# Altium project 200317 Brake Module R4.PrjPcb
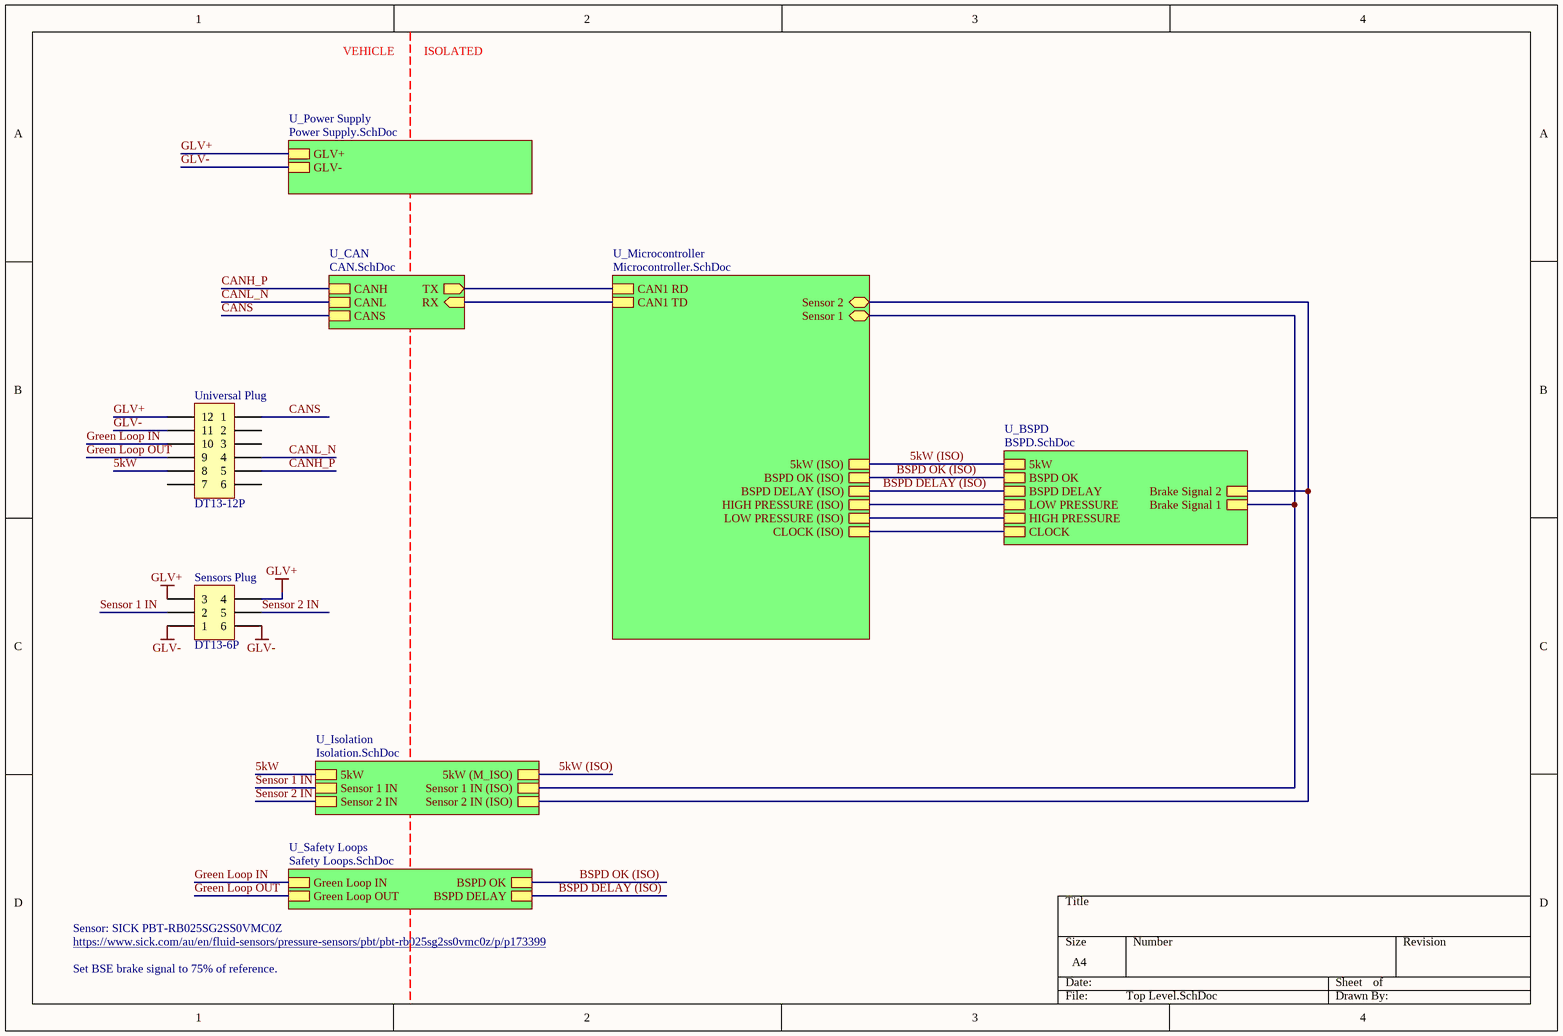
[diagram p0: Top Level.SchDoc]
8 sheets, 168 parts. Net scope: hierarchical (ports join the sheet entries above them; power ports are global).
Board file: Brake Module PCB.PcbDoc
Sheets:
  Top Level.SchDoc
    U_BSPD = BSPD.SchDoc
    U_Microcontroller = Microcontroller.SchDoc
    U_Safety Loops = Safety Loops.SchDoc
    U_Power Supply = Power Supply.SchDoc
    U_CAN = CAN.SchDoc
    U_Isolation = Isolation.SchDoc
      U_Input Filter = Input Filter.SchDoc

## Sheet Top Level.SchDoc
size A4

### Parts
Sensors_Plug  DT13-6P  [DT13-6P]
Universal_Plug  DT13-12P  [DT13-12P]

### Sub-sheets
U_BSPD = BSPD.SchDoc: BSPD OK, HIGH PRESSURE, LOW PRESSURE, CLOCK, 5kW, Brake Signal 1, Brake Signal 2, BSPD DELAY
U_CAN = CAN.SchDoc: CANS, RX (in), CANL, CANH, TX (out)
U_Isolation = Isolation.SchDoc: 5kW, 5kW (M_ISO), Sensor 2 IN, Sensor 1 IN, Sensor 2 IN (ISO), Sensor 1 IN (ISO)
U_Microcontroller = Microcontroller.SchDoc: BSPD OK (ISO), 5kW (ISO), CLOCK (ISO), HIGH PRESSURE (ISO), LOW PRESSURE (ISO), Sensor 2 (bidir), Sensor 1 (bidir), CAN1 RD, CAN1 TD, BSPD DELAY (ISO)
U_Power Supply = Power Supply.SchDoc: GLV+, GLV-
U_Safety Loops = Safety Loops.SchDoc: Green Loop OUT, Green Loop IN, BSPD OK, BSPD DELAY

### Nets
GLV+: Sensors_Plug.3 Sensors_Plug.4 Universal_Plug.12 ; sheet U_Power Supply/GLV+
GLV-: Sensors_Plug.1 Sensors_Plug.6 Universal_Plug.11 ; sheet U_Power Supply/GLV-
5kW: Universal_Plug.8 ; sheet U_Isolation/5kW
5kW (ISO): sheet U_BSPD/5kW, sheet U_Microcontroller/5kW (ISO), sheet U_Isolation/5kW (M_ISO)
BSPD DELAY (ISO): sheet U_BSPD/BSPD DELAY, sheet U_Microcontroller/BSPD DELAY (ISO), sheet U_Safety Loops/BSPD DELAY
BSPD OK (ISO): sheet U_BSPD/BSPD OK, sheet U_Microcontroller/BSPD OK (ISO), sheet U_Safety Loops/BSPD OK  [project net BSPD OK]
CANH_P: Universal_Plug.5 ; sheet U_CAN/CANH
CANL_N: Universal_Plug.4 ; sheet U_CAN/CANL
CANS: Universal_Plug.1 ; sheet U_CAN/CANS
CLOCK: sheet U_BSPD/CLOCK, sheet U_Microcontroller/CLOCK (ISO)
Green Loop IN: Universal_Plug.10 ; sheet U_Safety Loops/Green Loop IN
Green Loop OUT: Universal_Plug.9 ; sheet U_Safety Loops/Green Loop OUT
Sensor 1 IN: Sensors_Plug.2 ; sheet U_Isolation/Sensor 1 IN
Sensor 2 IN: Sensors_Plug.5 ; sheet U_Isolation/Sensor 2 IN
NetC33_1: sheet U_BSPD/Brake Signal 1, sheet U_Microcontroller/Sensor 1, sheet U_Isolation/Sensor 1 IN (ISO)
NetC38_1: sheet U_BSPD/Brake Signal 2, sheet U_Microcontroller/Sensor 2, sheet U_Isolation/Sensor 2 IN (ISO)
NetCAN_RX#2_1: sheet U_Microcontroller/CAN1 TD, sheet U_CAN/RX
NetCAN_TX#2_1: sheet U_Microcontroller/CAN1 RD, sheet U_CAN/TX
NetHigh_P_1: sheet U_BSPD/HIGH PRESSURE, sheet U_Microcontroller/LOW PRESSURE (ISO)
NetLow_P_1: sheet U_BSPD/LOW PRESSURE, sheet U_Microcontroller/HIGH PRESSURE (ISO)

Not connected (* = marked no-connect by the designer): Universal_Plug 2 3 6 7

### Notes on the sheet
- VEHICLE
- ISOLATED
- Sensor: SICK PBT-RB025SG2SS0VMC0Z
- https://www.sick.com/au/en/fluid-sensors/pressure-sensors/pbt/pbt-rb025sg2ss0vmc0z/p/p173399
- Set BSE brake signal to 75% of reference.

### Library data of the parts
Sensors_Plug = DT13-6P[[/\]]DT13-6P: Positions: 6; Pitch: 4.44mm; Row Spacing: 6.35mm; Angle: 90; Flange: Yes; Contact: Copper Alloy; Part Number: DT13-6P; Digikey Part Number: 1734-1025-ND; Digikey Link: https://www.digikey.com/product-detail/en/te-connectivity-deutsch-connectors/DT13-6P/1734-1025-ND/6566589
Universal_Plug = DT13-12P[[/\]]DT13-12P: Positions: 12; Pitch: 4.44mm; Row Spacing: 6.35mm; Angle: 90; Flange: Yes; Contact: Nickel; Part Number: DT13-12P; Digikey Part Number: 1734-1451-ND; Digikey Link: https://www.digikey.com.au/product-detail/en/te-connectivity-deutsch-connectors/DT13-12PA/1734-1451-ND/7220123

## Sheet BSPD.SchDoc
size A4
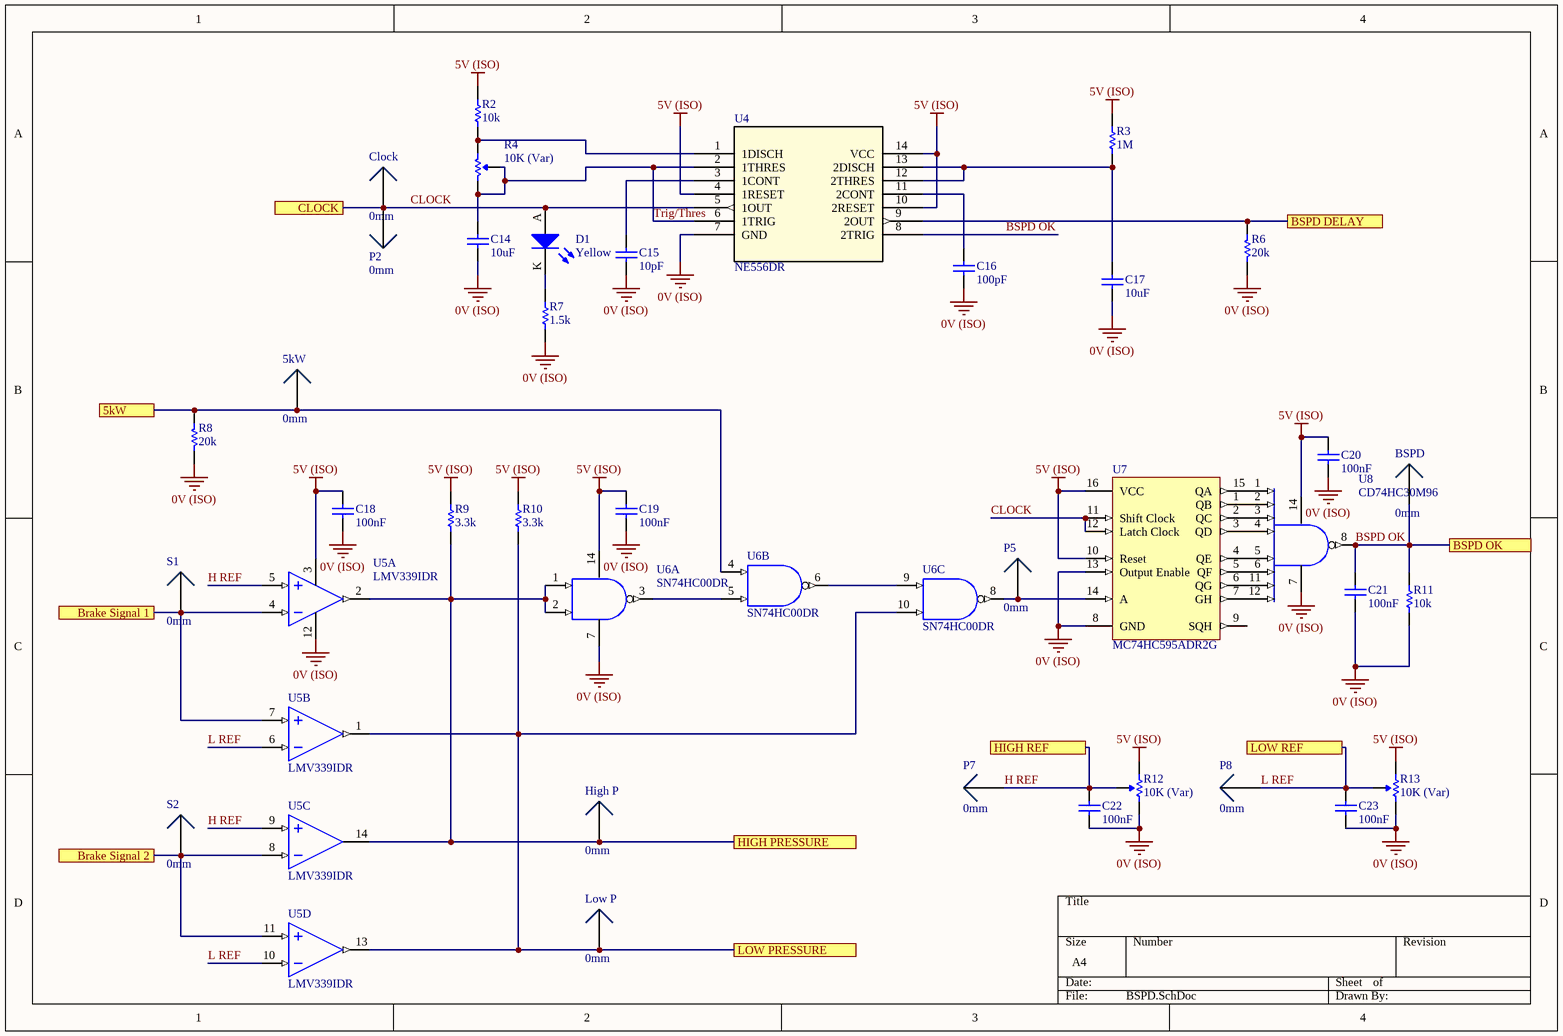
[diagram p1: BSPD.SchDoc]

### Parts
5kW  0mm  [SMD Test Point]
BSPD  0mm  [SMD Test Point]
C14  10uF  [0805]
C15  10pF  [0805]
C16  100pF  [0805]
C17  10uF  [0805]
C18  100nF  [0805]
C19  100nF  [0805]
C20  100nF  [0805]
C21  100nF  [0805]
C22  100nF  [0805]
C23  100nF  [0805]
Clock  0mm  [SMD Test Point]
D1  Yellow  [0805 LED]
High_P  0mm  [SMD Test Point]
Low_P  0mm  [SMD Test Point]
P2  0mm  [TH Test Point]
P5  0mm  [SMD Test Point]
P7  0mm  [TH Test Point]
P8  0mm  [TH Test Point]
R2  10k  [0805]
R3  1M  [0805]
R4  10K (Var)  [B 3296]
R6  20k  [0805]
R7  1.5k  [0805]
R8  20k  [0805]
R9  3.3k  [0805]
R10  3.3k  [0805]
R11  10k  [0805]
R12  10K (Var)  [B 3296]
R13  10K (Var)  [B 3296]
S1  0mm  [TH Test Point]
S2  0mm  [TH Test Point]
U4  NE556DR  [TI 14-SOIC]
U5  LMV339IDR  [TI 14-SOIC]  (parts A,B,C,D of 4)
U6  SN74HC00DR  [TI 14-SOIC]  (parts A,B,C of 4)
U7  MC74HC595ADR2G  [ON 16-SOIC]
U8  CD74HC30M96  [TI 14-SOIC]

### Ports
5kW, Brake Signal 1, Brake Signal 2, BSPD DELAY, BSPD OK, CLOCK, HIGH PRESSURE, HIGH REF, LOW PRESSURE, LOW REF

### Nets
0V (ISO): C14.1 C15.1 C16.1 C17.1 C18.1 C19.1 C20.1 C21.1 C22.1 C23.1 R6.2 R7.1 R8.2 R11.1 R12.1(CCW) R13.1(CCW) U4.7(GND) U5.12(V-) U6.7(GND) U7.8(GND) U7.13(Output_Enable) U8.7(GND)
5V (ISO): C18.2 C19.2 C20.2 R2.2 R3.2 R9.2 R10.2 R12.3(CW) R13.3(CW) U4.4(1RESET) U4.10(2RESET) U4.14(VCC) U5.3(V+) U6.14(VCC) U7.10(Reset) U7.16(VCC) U8.14(VCC)
5kW (ISO): 5kW.1 R8.1 U6.4(2A) ; port 5kW
BSPD DELAY (ISO): R6.1 U4.9(2OUT) ; port BSPD DELAY
BSPD OK: BSPD.1 C21.2 R11.2 U4.8(2TRIG) U8.8(Output) ; port BSPD OK
CLOCK: Clock.1 D1.A P2.1 U4.5(1OUT) U7.11(Shift_Clock) U7.12(Latch_Clock) ; port CLOCK
H REF: C22.2 P7.1 R12.2(Wiper) U5.5(IN_A+) U5.9(IN_C+) ; port HIGH REF
L REF: C23.2 P8.1 R13.2(Wiper) U5.6(IN_B-) U5.10(IN_D-) ; port LOW REF
Trig/Thres: C14.2 R4.1(CCW) R4.2(Wiper) U4.2(1THRES) U4.6(1TRIG)
NetC15_2: C15.2 U4.3(1CONT)
NetC16_2: C16.2 U4.11(2CONT)
NetC17_2: C17.2 R3.1 U4.12(2THRES) U4.13(2DISCH)
NetC33_1: S1.1 U5.4(IN_A-) U5.7(IN_B+) ; port Brake Signal 1
NetC38_1: S2.1 U5.8(IN_C-) U5.11(IN_D+) ; port Brake Signal 2
NetD1_K: D1.K R7.2
NetHigh_P_1: High_P.1 R9.1 U5.2(OUT_A) U5.14(OUT_C) U6.1(1A) U6.2(1B) ; port HIGH PRESSURE
NetLow_P_1: Low_P.1 R10.1 U5.1(OUT_B) U5.13(OUT_D) U6.10(3B) ; port LOW PRESSURE
NetP5_1: P5.1 U6.8(3Y) U7.14(A)
NetR2_1: R2.1 R4.3(CW) U4.1(1DISCH)
NetU6_3: U6.3(1Y) U6.5(2B)
NetU6_6: U6.6(2Y) U6.9(3A)
NetU7_1: U7.1(QB) U8.2(Input)
NetU7_2: U7.2(QC) U8.3(Input)
NetU7_3: U7.3(QD) U8.4(Input)
NetU7_4: U7.4(QE) U8.5(Input)
NetU7_5: U7.5(QF) U8.6(Input)
NetU7_6: U7.6(QG) U8.11(Input)
NetU7_7: U7.7(GH) U8.12(Input)
NetU7_15: U7.15(QA) U8.1(Input)

Not connected (* = marked no-connect by the designer): U7 9(SQH)

### Library data of the parts
5kW BSPD Clock High_P Low_P P5 = SMD Test Point: Positions: 1; Row Spacing: 0; Flange: No; Contact: NA; Part Number: SMD Test Point; Pitch: 0mm; Angle: 0
C14 C17 = GRM21BR6YA106KE43L: Manufacturer: muRata; Tolerance: 10%; Material: X5R; Rated Voltage: 50V; Part Number: GRM21BR6YA106KE43L; Value: 10uF; Digikey Part Number: 490-10514-6-ND
C15 = GRM21A5C2E100JW01D: Manufacturer: muRata; Tolerance: ±5%; Material: C0G, NP0; Rated Voltage: 250V; Part Number: GRM21A5C2E100JW01D; Value: 10pF; Digikey Part Number: 490-5530-1-ND
C16 = GCM2165C1H101JA16D: Manufacturer: muRata; Tolerance: ±5%; Material: C0G, NP0; Rated Voltage: 50V; Part Number: GCM2165C1H101JA16D; Value: 100pF; Digikey Part Number: 490-8031-1-ND
C18 C20-C23 = GCM21BR71H104KA37L: Manufacturer: muRata; Tolerance: ±10%; Material: X7R; Rated Voltage: 50V; Part Number: GCM21BR71H104KA37L; Value: 100nF; Digikey Part Number: 490-6064-1-ND
C19 = GCM21BR71E104KA37L: Manufacturer: muRata; Tolerance: 10%; Material: X7R; Rated Voltage: 25V; Part Number: GCM21BR71E104KA37L; Value: 100nF
D1 = SML-211YTT86: Yellow LED Indication - Discrete 1.75V 0805 (2012 Metric); Manufacturer: ROHM Semiconductor; Part Number: SML-211YTT86; Colour: Yellow; Digikey Part Number: 511-1293-1-ND; Digikey Link: https://www.digikey.com/product-detail/en/rohm-semiconductor/SML-211YTT86/511-1293-1-ND/637106
P2 P7 P8 S1 S2 = TH Test Point: Positions: 1; Angle: 0; Flange: No; Contact: NA; Part Number: TH Test Point; Pitch: 0mm; Row Spacing: 0mm
R2 R11 = RC0805FR0710KL: Manufacturer: YAGEO; Tolerance: 0.01; Rated Voltage: 0.125W; Part Number: RC0805FR0710KL; Value: 10k; Material: FR-07
R3 = RC0805FR071ML: Manufacturer: YAGEO; Tolerance: 0.01; Rated Voltage: 0.125W; Part Number: RC0805FR071ML; Value: 1M; Material: FR-07
R4 R12 R13 = 3296W-1-103LF: Manufacturer: Bournes Inc; Tolerance: 0.1; Rated Voltage: 0.5W; Part Number: 3296W-1-103LF; Value: 10K (Var); Digikey Part Number: 3296W-103LF-ND
R6 R8 = RC0805FR0720KL: Manufacturer: YAGEO; Tolerance: 0.01; Rated Voltage: 0.125W; Part Number: RC0805FR0720KL; Value: 20k; Material: FR-07
R7 = RC0805FR071K5L: Manufacturer: YAGEO; Tolerance: 0.01; Rated Voltage: 0.125W; Part Number: RC0805FR071K5L; Value: 1.5k; Material: FR-07
R9 R10 = RC0805FR073K3L: Manufacturer: YAGEO; Tolerance: 0.01; Rated Voltage: 0.125W; Part Number: RC0805FR073K3L; Value: 3.3k; Material: FR-07
U4 = NE556DR: IC OSC TIMER DUAL 100KHZ 14SOIC; Manufacturer: Texas Instruments; Part Number: NE556DR; Digikey Part Number: 296-26240-1-ND; Digikey Link: https://www.digikey.com/product-detail/en/texas-instruments/NE556DR/296-26240-1-ND/2254905
U5 = LMV339IDR: Comparator General Purpose Open Collector 14-SOIC; Manufacturer: Texas Instruments; Part Number: LMV339IDR; Digikey Part Number: 296-6611-2-ND; Digikey Link: https://www.digikey.com/product-detail/en/texas-instruments/LMV339MTX-NOPB/296-35446-1-ND/3739150
U6 = SN74HC00DR: NAND Gate IC 4 Channel 14-SOIC; Manufacturer: Texas Instruments; Part Number: SN74HC00DR; Digikey Part Number: 296-1187-2-ND; Digikey Link: https://www.digikey.com.au/product-detail/en/texas-instruments/SN74HC00DR/296-1187-2-ND/276830
U7 = MC74HC595ADR2G: IC SHIFT REGISTR 8BIT 3ST 16SOIC; Manufacturer: ON Semiconductor; Part Number: MC74HC595ADR2G; Digikey Part Number: MC74HC595ADR2GOSCT-ND; Digikey Link: https://www.digikey.com/product-detail/en/on-semiconductor/MC74HC595ADR2G/MC74HC595ADR2GOSCT-ND/1139727
U8 = CD74HC30M96: IC GATE NAND 1CH 8-INP 14SOIC; Manufacturer: Texas Instruments; Part Number: CD74HC30M96; Digikey Part Number: 296-14521-1-ND; Digikey Link: https://www.digikey.com/product-detail/en/texas-instruments/CD74HC30M96/296-14521-1-ND/555580

## Sheet Microcontroller.SchDoc
size A3
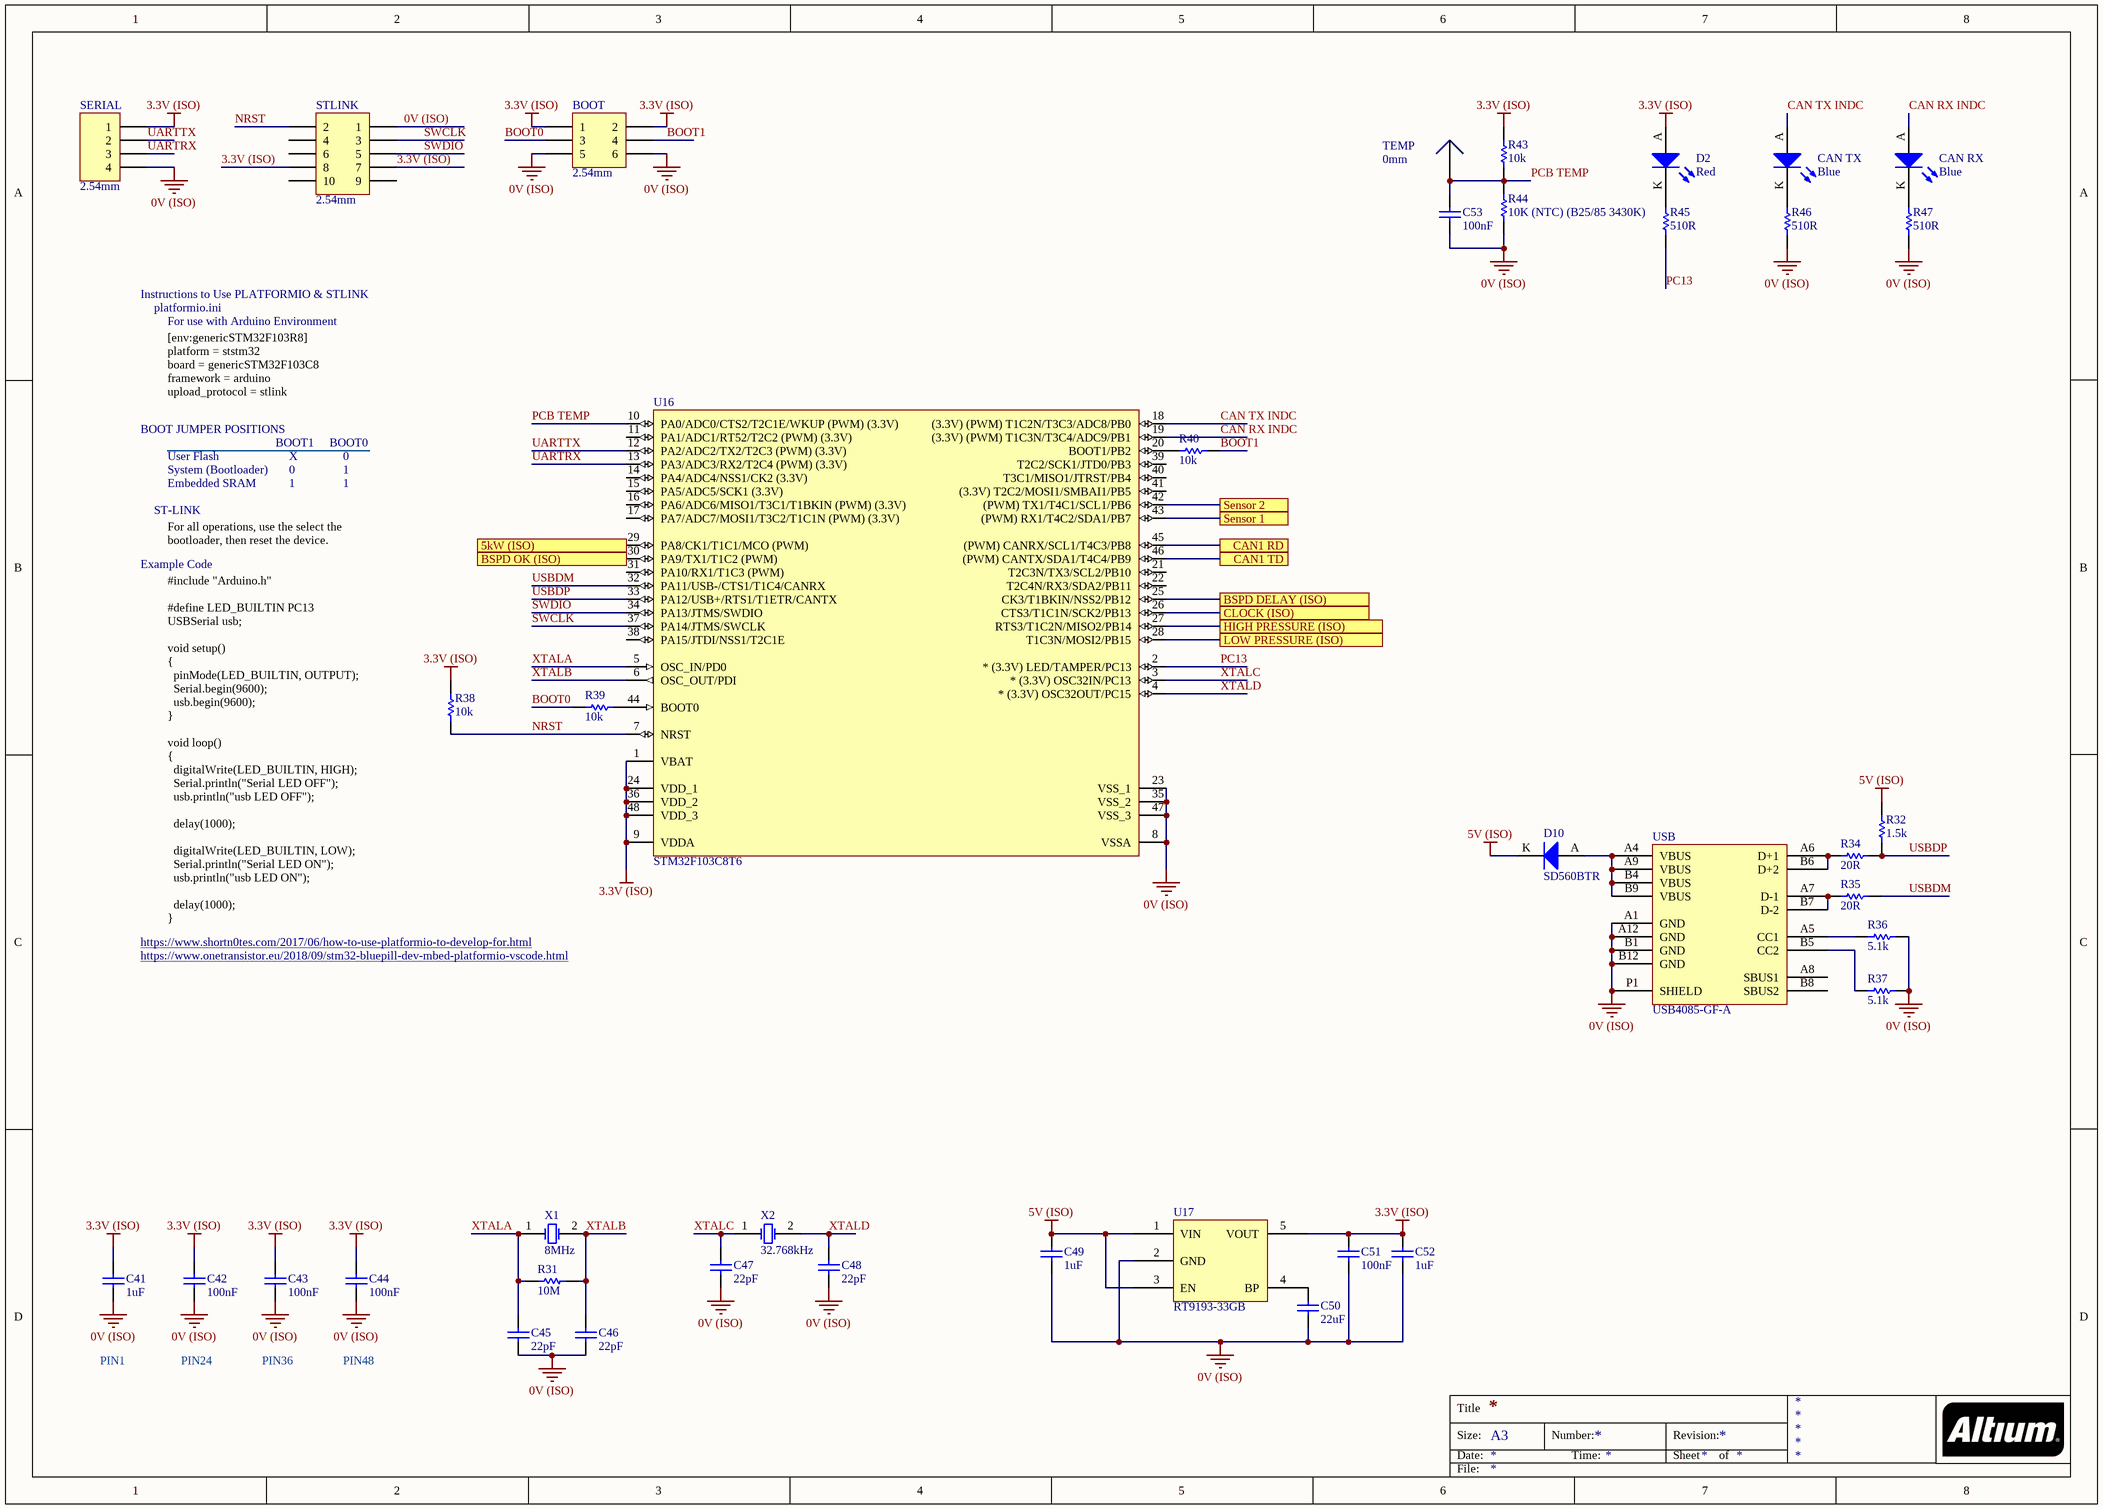
[diagram p2: Microcontroller.SchDoc]

### Parts
(Parts that share a designator on the sheet are numbered #1, #2 ... from top to bottom, then left to right.)
BOOT  2.54mm  [TH 2.54mm Header 2x3]
C41  1uF  [0805]
C42  100nF  [0805]
C43  100nF  [0805]
C44  100nF  [0805]
C45  22pF  [0805]
C46  22pF  [0805]
C47  22pF  [0805]
C48  22pF  [0805]
C49  1uF  [0805]
C50  22uF  [1206]
C51  100nF  [0805]
C52  1uF  [0805]
C53  100nF  [0805]
CAN_RX#1  Blue  [0805 LED]
CAN_TX#1  Blue  [0805 LED]
D2  Red  [0805 LED]
D10  SD560BTR  [SMB Diode]
R31  10M  [0805]
R32  1.5k  [0805]
R34  20R  [0805]
R35  20R  [0805]
R36  5.1k  [0805]
R37  5.1k  [0805]
R38  10k  [0805]
R39  10k  [0805]
R40  10k  [0805]
R43  10k  [0805]
R44  10K (NTC) (B25/85 3430K)  [0805]
R45  510R  [0805]
R46  510R  [0805]
R47  510R  [0805]
SERIAL  2.54mm  [TH 2.54mm Header 1x4]
STLINK  2.54mm  [TH 2.54mm Header 2x5]
TEMP  0mm  [SMD Test Point]
U16  STM32F103C8T6  [STM 48-LQFP]
U17  RT9193-33GB  [RICHTEK SOT-23-5]
USB  USB4085-GF-A  [USB4085-GF-A]
X1  8MHz  [Abracon HC-49/US]
X2  32.768kHz  [EPSON 2-SMD]

### Ports
5kW (ISO), BSPD DELAY (ISO), BSPD OK (ISO), CAN1 RD, CAN1 TD, CLOCK (ISO), HIGH PRESSURE (ISO), LOW PRESSURE (ISO), Sensor 1, Sensor 2

### Nets
0V (ISO): BOOT.5 BOOT.6 C41.1 C42.1 C43.1 C44.1 C45.1 C46.1 C47.1 C48.1 C49.1 C50.1 C51.1 C52.1 C53.1 R36.2 R37.2 R44.1 R46.1 R47.1 SERIAL.4 STLINK.1 U16.8(VSSA) U16.23(VSS_1) U16.35(VSS_2) U16.47(VSS_3) U17.2(GND) USB.A1(GND) USB.A12(GND) USB.B1(GND) USB.B12(GND) USB.P1(SHIELD)
3.3V (ISO): BOOT.1 BOOT.2 C41.2 C42.2 C43.2 C44.2 C51.2 C52.2 D2.A R38.2 R43.2 SERIAL.1 STLINK.7 STLINK.8 U16.1(VBAT) U16.9(VDDA) U16.24(VDD_1) U16.36(VDD_2) U16.48(VDD_3) U17.5(VOUT)
5V (ISO): C49.2 D10.K R32.2 U17.1(VIN) U17.3(EN)
5kW (ISO): U16.29(PA8/CK1/T1C1/MCO_(PWM)) ; port 5kW (ISO)
BOOT0: BOOT.3 R39.1
BOOT1: BOOT.4 R40.2
BSPD DELAY (ISO): U16.25(CK3/T1BKIN/NSS2/PB12) ; port BSPD DELAY (ISO)
BSPD OK: U16.30(PA9/TX1/T1C2_(PWM)) ; port BSPD OK (ISO)
CAN RX INDC: CAN_RX#1.A U16.19((3.3V)_(PWM)_T1C3N/T3C4/ADC9/PB1)
CAN TX INDC: CAN_TX#1.A U16.18((3.3V)_(PWM)_T1C2N/T3C3/ADC8/PB0)
CLOCK: U16.26(CTS3/T1C1N/SCK2/PB13) ; port CLOCK (ISO)
NRST: R38.1 STLINK.2 U16.7(NRST)
PC13: R45.1 U16.2(*_(3.3V)_LED/TAMPER/PC13)
PCB TEMP: C53.2 R43.1 R44.2 TEMP.1 U16.10(PA0/ADC0/CTS2/T2C1E/WKUP_(PWM)_(3.3V))
SWCLK: STLINK.3 U16.37(PA14/JTMS/SWCLK)
SWDIO: STLINK.5 U16.34(PA13/JTMS/SWDIO)
UARTRX: SERIAL.3 U16.13(PA3/ADC3/RX2/T2C4_(PWM)_(3.3V))
UARTTX: SERIAL.2 U16.12(PA2/ADC2/TX2/T2C3_(PWM)_(3.3V))
USBDM: R35.2 U16.32(PA11/USB-/CTS1/T1C4/CANRX)
USBDP: R32.1 R34.2 U16.33(PA12/USB+/RTS1/T1ETR/CANTX)
XTALA: C45.2 R31.1 U16.5(OSC_IN/PD0) X1.1(OSC1)
XTALB: C46.2 R31.2 U16.6(OSC_OUT/PDI) X1.2(OSC2)
XTALC: C47.2 U16.3(*_(3.3V)_OSC32IN/PC13) X2.1(OSC1)
XTALD: C48.2 U16.4(*_(3.3V)_OSC32OUT/PC15) X2.2(OSC2)
NetC33_1: U16.43((PWM)_RX1/T4C2/SDA1/PB7) ; port Sensor 1
NetC38_1: U16.42((PWM)_TX1/T4C1/SCL1/PB6) ; port Sensor 2
NetC50_2: C50.2 U17.4(BP)
NetCAN_RX#1_K: CAN_RX#1.K R47.2
NetCAN_RX#2_1: U16.46((PWM)_CANTX/SDA1/T4C4/PB9) ; port CAN1 TD
NetCAN_TX#1_K: CAN_TX#1.K R46.2
NetCAN_TX#2_1: U16.45((PWM)_CANRX/SCL1/T4C3/PB8) ; port CAN1 RD
NetD2_K: D2.K R45.2
NetD10_A: D10.A USB.A4(VBUS) USB.A9(VBUS) USB.B4(VBUS) USB.B9(VBUS)
NetHigh_P_1: U16.28(T1C3N/MOSI2/PB15) ; port LOW PRESSURE (ISO)
NetLow_P_1: U16.27(RTS3/T1C2N/MISO2/PB14) ; port HIGH PRESSURE (ISO)
NetR34_1: R34.1 USB.A6(D+1) USB.B6(D+2)
NetR35_1: R35.1 USB.A7(D-1) USB.B7(D-2)
NetR36_1: R36.1 USB.A5(CC1)
NetR37_1: R37.1 USB.B5(CC2)
NetR39_2: R39.2 U16.44(BOOT0)
NetR40_1: R40.1 U16.20(BOOT1/PB2)

Not connected (* = marked no-connect by the designer): STLINK 4 6 9 10; U16 11(PA1/ADC1/RT52/T2C2_(PWM)_(3.3V)) 14(PA4/ADC4/NSS1/CK2_(3.3V)) 15(PA5/ADC5/SCK1_(3.3V)) 16(PA6/ADC6/MISO1/T3C1/T1BKIN_(PWM)_(3.3V)) 17(PA7/ADC7/MOSI1/T3C2/T1C1N_(PWM)_(3.3V)) 21(T2C3N/TX3/SCL2/PB10) 22(T2C4N/RX3/SDA2/PB11) 31(PA10/RX1/T1C3_(PWM)) 38(PA15/JTDI/NSS1/T2C1E) 39(T2C2/SCK1/JTD0/PB3) 40(T3C1/MISO1/JTRST/PB4) 41((3.3V)_T2C2/MOSI1/SMBAI1/PB5); USB A8(SBUS1) B8(SBUS2)

### Notes on the sheet
- Instructions to Use PLATFORMIO & STLINK
- platformio.ini
- For use with Arduino Environment
- BOOT JUMPER POSITIONS
- [env:genericSTM32F103R8]
  platform = ststm32
  board = genericSTM32F103C8
  framework = arduino
  upload_protocol = stlink
- BOOT1
- BOOT0
- ST-LINK
- User Flash
- System (Bootloader)
- Embedded SRAM
- X
- 1
- 0
- Example Code
- For all operations, use the select the bootloader, then reset the device.
- #include "Arduino.h"
  #define LED_BUILTIN PC13
  USBSerial usb;
  void setup()
  {
  pinMode(LED_BUILTIN, OUTPUT);
  Serial.begin(9600);
  usb.begin(9600);
  }
  void loop()
  {
  digitalWrite(LED_BUILTIN, HIGH);
  Serial.println("Serial LED OFF");
  usb.println("usb LED OFF");
  delay(1000);
  digitalWrite(LED_BUILTIN, LOW);
  Serial.println("Serial LED ON");
  usb.println("usb LED ON");
  delay(1000);
  }
- https://www.shortn0tes.com/2017/06/how-to-use-platformio-to-develop-for.html
- https://www.onetransistor.eu/2018/09/stm32-bluepill-dev-mbed-platformio-vscode.html
- PIN1
- PIN24
- PIN36
- PIN48
- Title
- Size:
- Date:
- A3
- Number:
- Time:
- Revision:
- Sheet
- of
- File:

### Library data of the parts
BOOT = TH 2.54mm Header 2x3: Positions: 6; Angle: 0; Flange: No; Contact: NA; Part Number: TH 2.54mm Header 2x3; Pitch: 2.54mm; Row Spacing: 2.54mm
C41 C49 C52 = AC0805KKX7R8BB105: Manufacturer: YAGEO; Tolerance: 10%; Material: X7R; Rated Voltage: 25V; Part Number: AC0805KKX7R8BB105; Value: 1uF
C42-C44 C51 C53 = GCM21BR71H104KA37L: as C18 on sheet BSPD; Part Number: GCM21BR71H104KA37L; Value: 100nF; Digikey Part Number: 490-6064-1-ND
C45-C48 = GRM21A5C2E220JW01D: Manufacturer: muRata; Tolerance: ±5%; Material: C0G, NP0; Rated Voltage: 250V; Part Number: GRM21A5C2E220JW01D; Value: 22pF; Digikey Part Number: 490-5534-1-ND
C50 = CC1206MKX5R7BB226: Manufacturer: YAGEO; Tolerance: 20%; Material: Ceramic; Rated Voltage: 16V; Part Number: CC1206MKX5R7BB226; Value: 22uF; Digikey Part Number: 311-1997-2-ND
CAN_RX#1 CAN_TX#1 = SML-MN2BCTT86C: LED BLUE CLEAR 2012 SMD; Manufacturer: ROHM Semiconductor; Part Number: SML-MN2BCTT86C; Colour: Blue; Digikey Part Number: 846-1207-1-ND; Digikey Link: https://www.digikey.com/product-detail/en/rohm-semiconductor/SMLMN2BCTT86C/846-1207-1-ND/6057239
D2 = SML-210LTT86: Red LED Indication - Discrete 1.75V 0805 (2012 Metric); Manufacturer: ROHM Semiconductor; Part Number: SML-210LTT86; Colour: Red; Digikey Part Number: 511-1286-1-ND; Digikey Link: https://www.digikey.com/product-detail/en/rohm-semiconductor/SML-210LTT86/511-1286-1-ND/637099
D10 = SD560BTR: 1.2V_F 600V 5A SMB; Manufacturer: SMC Diode Solutions; Part Number: SD560BTR; Digikey Part Number: 1655-1530-2-ND; Digikey Link: https://www.digikey.com/product-detail/en/smc-diode-solutions/SD560BTR/1655-1530-2-ND/6022620
R31 = RC0805FR0710ML: Manufacturer: YAGEO; Tolerance: 0.01; Rated Voltage: 0.125W; Part Number: RC0805FR0710ML; Value: 10M; Material: FR-07
R32 = RC0805FR071K5L: as R7 on sheet BSPD; Part Number: RC0805FR071K5L; Value: 1.5k; Material: FR-07
R34 R35 = RC0805FR0720RL: Manufacturer: YAGEO; Tolerance: 0.01; Rated Voltage: 0.125W; Part Number: RC0805FR0720RL; Value: 20R; Material: FR-07
R36 R37 = RC0805FR075K1L: Manufacturer: YAGEO; Tolerance: 0.01; Rated Voltage: 0.125W; Part Number: RC0805FR075K1L; Value: 5.1k; Material: FR-07
R38-R40 R43 = RC0805FR0710KL: as R2 on sheet BSPD; Part Number: RC0805FR0710KL; Value: 10k; Material: FR-07
  R38 R39: Digikey Part Number: 311-10.0KCRCT-ND
R44 = NTCS0805E3103FLT: Manufacturer: Vishay Beyschlag; Tolerance: 0.01; Rated Voltage: 210mW; Part Number: NTCS0805E3103FLT; Value: 10K (NTC) (B25/85 3430K); Digikey Part Number: BC2733CT-ND
R45-R47 = RC0805FR07510RL: Manufacturer: YAGEO; Tolerance: 0.01; Rated Voltage: 0.125W; Part Number: RC0805FR07510RL; Value: 510R; Material: FR-07
SERIAL = TH 2.54mm Header 1x4: Positions: 4; Angle: 0; Flange: No; Contact: NA; Part Number: TH 2.54mm Header 1x4; Pitch: 2.54mm; Row Spacing: 2.54mm
STLINK = TH 2.54mm Header 2x5: Positions: 10; Angle: 0; Flange: No; Contact: NA; Part Number: TH 2.54mm Header 2x5; Pitch: 2.54mm; Row Spacing: 2.54mm
TEMP = SMD Test Point: as 5kW on sheet BSPD; Part Number: SMD Test Point; Pitch: 0mm; Angle: 0
U16 = STM32F103C8T6: ARM® Cortex®-M3 STM32F1 Microcontroller IC 32-Bit 72MHz 64KB (64K x 8) FLASH; Manufacturer: STMicroelectronics; Part Number: STM32F103C8T6; Digikey Part Number: 497-6063-ND; Digikey Link: https://www.digikey.com/product-detail/en/stmicroelectronics/STM32F103C8T6/497-6063-ND/1646338
U17 = RT9193-33GB: IC REG LINEAR 3.3V 300MA SOT23-5; Manufacturer: Richtek; Part Number: RT9193-33GB; Digikey Part Number: 1028-1014-1-ND; Digikey Link: https://www.digikey.com/products/en?keywords=1028-1014-1-ND
USB = USB4085-GF-A: USB - C (Type - C) USB 2.0 Receptacle Connector 16 Position Through Hole, Right Angle; Angle: 90; Part Number: USB4085-GF-A; Digikey Part Number: 2073-USB4085-GF-ACT-ND; Digikey Link: https://www.digikey.ee/product-detail/en/gct/USB4085-GF-A/2073-USB4085-GF-ACT-ND/9859733
X1 = ABLS-8.000MHZ-B4-T: Manufacturer: Abracon LLC; Load Capacitance: 18pF; ESR: 80R; Part Number: ABLS-8.000MHZ-B4-T; Value: 8MHz; Digikey Part Number: 535-10212-2-ND; Digikey Link: https://www.digikey.com/product-detail/en/abracon-llc/ABLS-8.000MHZ-B4-T/535-10212-2-ND/2184155
X2 = FC-135 32.7680KA-A5: Manufacturer: EPSON; Load Capacitance: 12.5pF; ESR: 70k; Part Number: FC-135 32.7680KA-A5; Value: 32.768kHz; Digikey Part Number: SER4103TR-ND; Digikey Link: https://www.digikey.com/product-detail/en/epson/FC-135-32.7680KA-A5/SER4103TR-ND/5259895

## Sheet Safety Loops.SchDoc
size A4
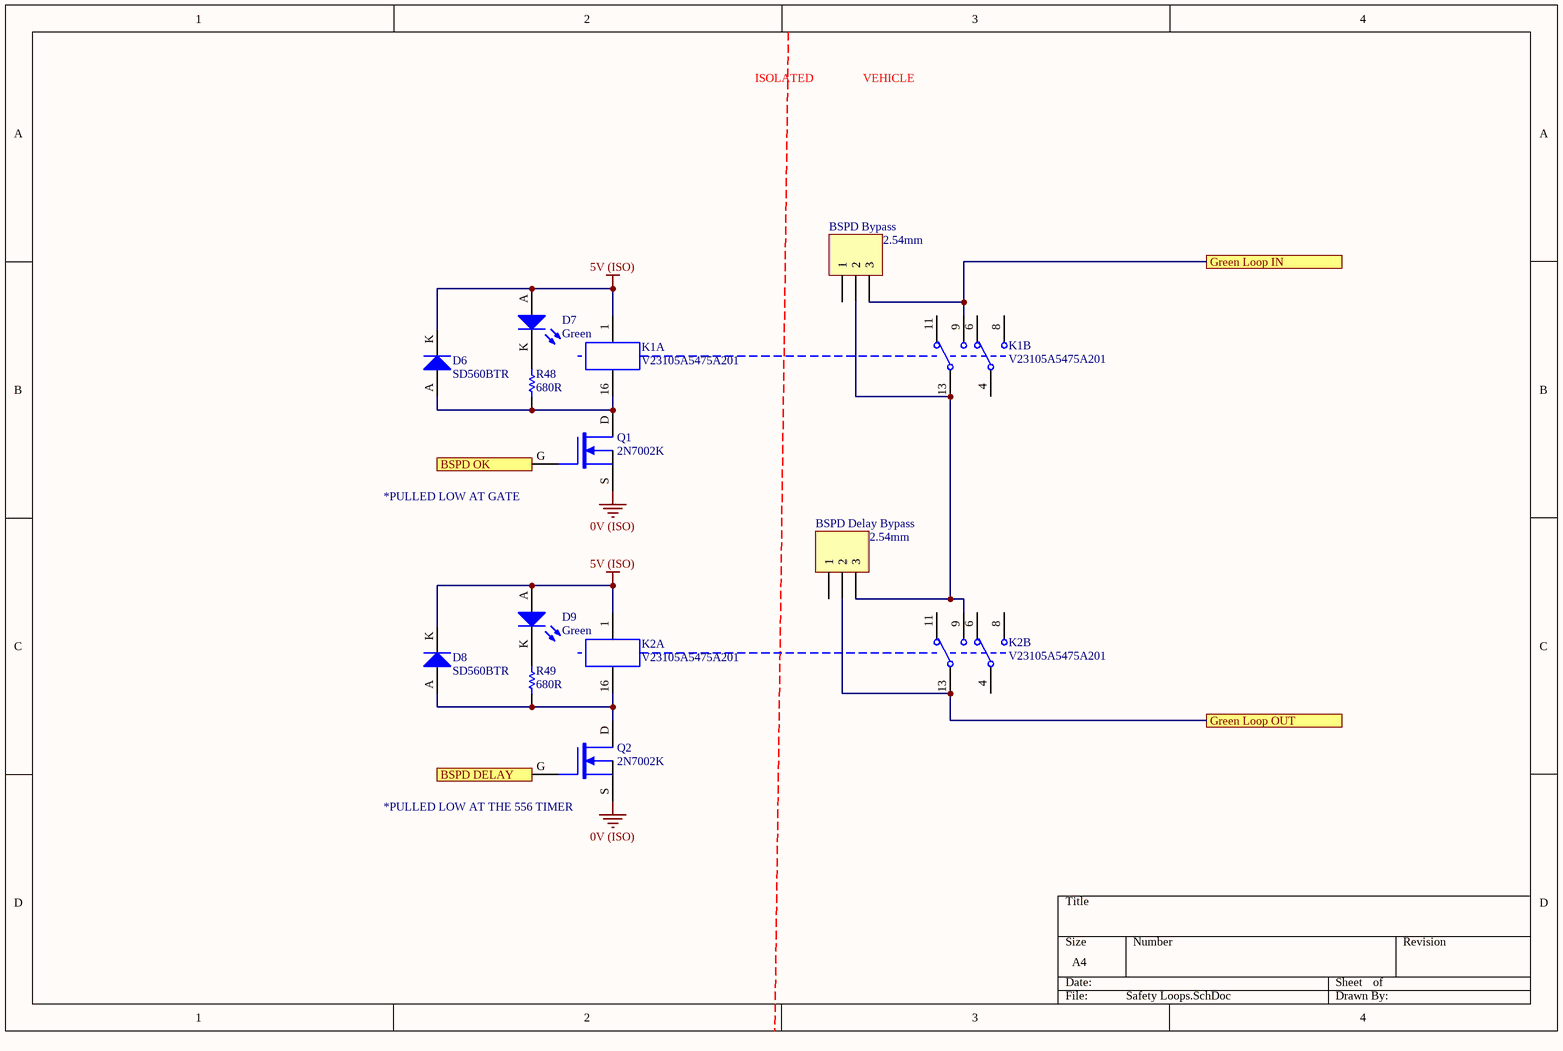
[diagram p3: Safety Loops.SchDoc]

### Parts
BSPD_Bypass  2.54mm  [TH 2.54mm Header 1x3]
BSPD_Delay_Bypass  2.54mm  [TH 2.54mm Header 1x3]
D6  SD560BTR  [SMB Diode]
D7  Green  [0805 LED]
D8  SD560BTR  [SMB Diode]
D9  Green  [0805 LED]
K1  V23105A5475A201  [TI 2-DIL]  (parts A,B of 2)
K2  V23105A5475A201  [TI 2-DIL]  (parts A,B of 2)
Q1  2N7002K  [ON SOT-23 MOSFET]
Q2  2N7002K  [ON SOT-23 MOSFET]
R48  680R  [0805]
R49  680R  [0805]

### Ports
BSPD DELAY, BSPD OK, Green Loop IN, Green Loop OUT

### Nets
0V (ISO): Q1.S Q2.S
5V (ISO): D6.K D7.A D8.K D9.A K1.1 K2.1
BSPD DELAY (ISO): Q2.G ; port BSPD DELAY
BSPD OK: Q1.G ; port BSPD OK
Green Loop IN: BSPD_Bypass.3 K1.9 ; port Green Loop IN
Green Loop OUT: BSPD_Delay_Bypass.2 K2.13 ; port Green Loop OUT
NetBSPD_Bypass_2: BSPD_Bypass.2 BSPD_Delay_Bypass.3 K1.13 K2.9
NetD6_A: D6.A K1.16 Q1.D R48.1
NetD7_K: D7.K R48.2
NetD8_A: D8.A K2.16 Q2.D R49.1
NetD9_K: D9.K R49.2

Not connected (* = marked no-connect by the designer): BSPD_Bypass 1; BSPD_Delay_Bypass 1; K1 4 6 8 11; K2 4 6 8 11

### Notes on the sheet
- ISOLATED
- VEHICLE
- *PULLED LOW AT GATE
- (near Q2) *PULLED LOW AT THE 556 TIMER

### Library data of the parts
BSPD_Bypass BSPD_Delay_Bypass = TH 2.54mm Header 1x3: Positions: 3; Angle: 0; Flange: No; Contact: NA; Part Number: TH 2.54mm Header 1x3; Pitch: 2.54mm; Row Spacing: 2.54mm
D6 D8 = SD560BTR: as D10 on sheet Microcontroller; Part Number: SD560BTR; Digikey Part Number: 1655-1530-2-ND; Digikey Link: https://www.digikey.com/product-detail/en/smc-diode-solutions/SD560BTR/1655-1530-2-ND/6022620
D7 D9 = SML-210FTT86: Green LED Indication - Discrete 1.75V 0805 (2012 Metric); Manufacturer: ROHM Semiconductor; Part Number: SML-210FTT86; Colour: Green; Digikey Part Number: 511-1285-1-ND; Digikey Link: https://www.digikey.com/product-detail/en/rohm-semiconductor/SML-210FTT86/511-1285-1-ND/637098
K1 K2 = V23105A5475A201: 5V DPDT Relay 3A 220VDC; Manufacturer: Axicom; Part Number: V23105A5475A201; Digikey Part Number: PB383-ND; Digikey Link: https://www.digikey.com/products/en?mpart=V23105A5001A201&v=41
Q1 Q2 = 2N7002K: 60V 380mA, NFET MOSTFET (Small Signal); Manufacturer: ON Semiconductor; Published: 24-Mar-1999; LatestRevisionDate: 29-May-2009; LatestRevisionNote: IPC-7351 Footprint Added.; PackageVersion: Sep-2000; PackageReference: SOT-343; Publisher: Altium Limited; PackageDescription: 4-Pin SOT-343 Package 1.3 mm Pitch, 2.1 mm Lead Span; Part Number: 2N7002K; Digikey Part Number: 2N7002KCT-ND; Digikey Link: https://www.digikey.com/product-detail/en/on-semiconductor/2N7002K/2N7002KCT-ND/2060375; Qty: 30
R48 R49 = RC0805FR07680RL: Manufacturer: YAGEO; Tolerance: 0.01; Rated Voltage: 0.125W; Part Number: RC0805FR07680RL; Value: 680R; Material: FR-07

## Sheet Power Supply.SchDoc
size A4
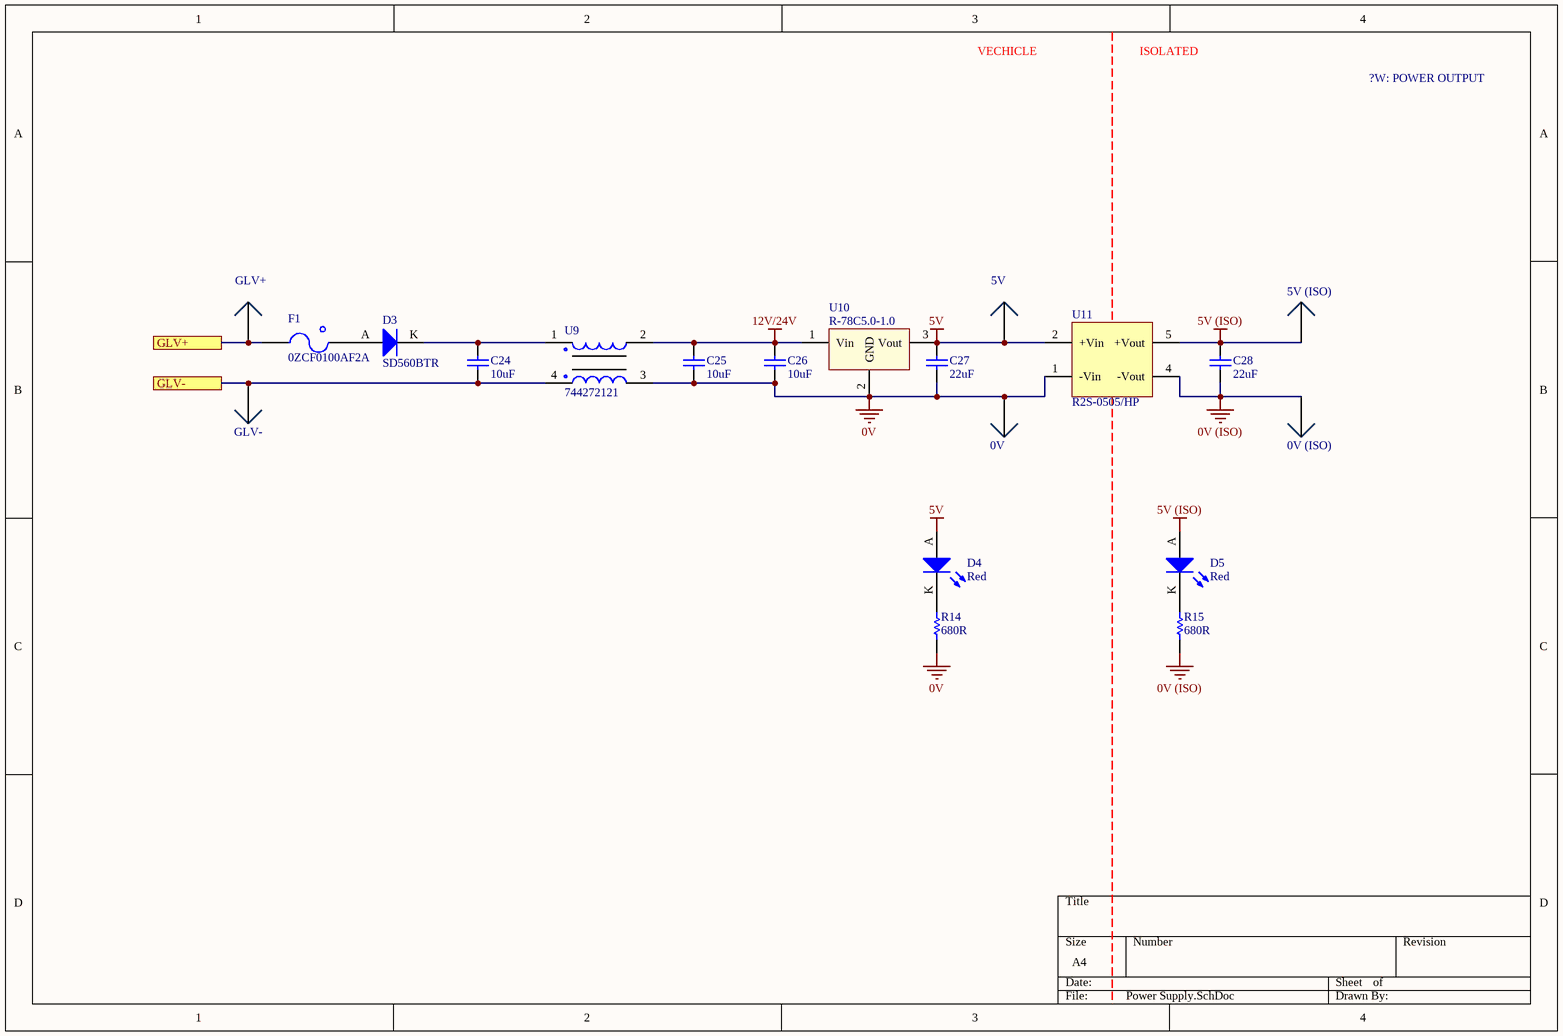
[diagram p4: Power Supply.SchDoc]

### Parts
0V  0mm  [SMD Test Point]  (value not drawn)
0V_(ISO)  0mm  [SMD Test Point]  (value not drawn)
5V  0mm  [SMD Test Point]  (value not drawn)
5V_(ISO)  0mm  [SMD Test Point]  (value not drawn)
C24  10uF  [0805]
C25  10uF  [0805]
C26  10uF  [0805]
C27  22uF  [1206]
C28  22uF  [1206]
D3  SD560BTR  [SMB Diode]
D4  Red  [0805 LED]
D5  Red  [0805 LED]
F1  0ZCF0100AF2A  [2920]
GLV+  0mm  [SMD Test Point]  (value not drawn)
GLV-  0mm  [SMD Test Point]  (value not drawn)
R14  680R  [0805]
R15  680R  [0805]
U9  744272121  [Wurth 4-PC Pad]
U10  R-78C5.0-1.0  [RECOM 3-SIP]
U11  R2S-0505/HP  [RECOM 8-SMD (5 Pin)]

### Ports
GLV+, GLV-

### Nets
0V: 0V.1 C25.1 C26.1 C27.1 R14.1 U9.3 U10.2(GND) U11.1(-Vin)
0V (ISO): 0V_(ISO).1 C28.1 R15.1 U11.4(-Vout)
5V: 5V.1 C27.2 D4.A U10.3(Vout) U11.2(+Vin)
5V (ISO): 5V_(ISO).1 C28.2 D5.A U11.5(+Vout)
12V/24V: C25.2 C26.2 U9.2 U10.1(Vin)
GLV+: F1.1 GLV+.1 ; port GLV+
GLV-: C24.1 GLV-.1 U9.4 ; port GLV-
NetC24_2: C24.2 D3.K U9.1
NetD3_A: D3.A F1.2
NetD4_K: D4.K R14.2
NetD5_K: D5.K R15.2

### Notes on the sheet
- VECHICLE
- ISOLATED
- ?W: POWER OUTPUT

### Library data of the parts
0V 0V_(ISO) 5V 5V_(ISO) GLV+ GLV- = SMD Test Point: as 5kW on sheet BSPD; Part Number: SMD Test Point; Pitch: 0mm; Angle: 0
C24-C26 = GRM21BR6YA106KE43L: as C14 on sheet BSPD; Part Number: GRM21BR6YA106KE43L; Value: 10uF; Digikey Part Number: 490-10514-6-ND
C27 C28 = CC1206MKX5R7BB226: as C50 on sheet Microcontroller; Part Number: CC1206MKX5R7BB226; Value: 22uF; Digikey Part Number: 311-1997-2-ND
D3 = SD560BTR: as D10 on sheet Microcontroller; Part Number: SD560BTR; Digikey Part Number: 1655-1530-2-ND; Digikey Link: https://www.digikey.com/product-detail/en/smc-diode-solutions/SD560BTR/1655-1530-2-ND/6022620
D4 D5 = SML-210LTT86: as D2 on sheet Microcontroller; Part Number: SML-210LTT86; Colour: Red; Digikey Part Number: 511-1286-1-ND; Digikey Link: https://www.digikey.com/product-detail/en/rohm-semiconductor/SML-210LTT86/511-1286-1-ND/637099
F1 = 0ZCF0100AF2A: PTC RESET FUSE 60V 1A 292; Manufacturer: Littelfuse Inc.; Part Number: 0ZCF0100AF2A; Digikey Part Number: 507-2070-1-ND; Digikey Link: https://www.digikey.com/product-detail/en/bel-fuse-inc/0ZCF0100AF2A/507-2070-1-ND/6210547
R14 R15 = RC0805FR07680RL: as R48 on sheet Safety Loops; Part Number: RC0805FR07680RL; Value: 680R; Material: FR-07
U9 = 744272121: 120µH @ 100kHz 2 Line Common Mode Choke Surface Mount 460 Ohms @ 30MHz 2.5A DCR 25mOhm; Manufacturer: Wurth Electronics Inc; Inductance: 120uH @ 100kHz; Part Number: 744272121; Impedence: 460 Ohms @ 30MHz; Material: Wirewound; Rated Current: 2.5A; Digikey Part Number: 732-1489-1-ND; Digikey Link: https://www.digikey.com/product-detail/en/w-rth-elektronik/744272121/732-1489-1-ND/1639501
U10 = R-78C5.0-1.0: CONV DC/DC 1A 5V OUT SIP VERT; Manufacturer: Recom; Isolation: Non-Isolated; Part Number: R-78C5.0-1.0; Digikey Part Number: 945-1395-5-ND; Digikey Link: https://www.digikey.com.au/product-detail/en/recom-power/R-78C5.0-1.0/945-1395-5-ND/2652148
U11 = R2S-0505/HP: Isolated Module DC DC Converter 1 Output 3.3V 606mA 4.5V - 5.5V Input; Manufacturer: Recom; Output Voltage: 5V; Output Power: 2W; Efficiency: 0.85; Part Number: R2S-0505/HP; Input Voltage: 4.5V-5.5V; Isolation: Isolated; Digikey Part Number: 945-1764-5-ND; Digikey Link: https://www.digikey.com/product-detail/en/recom-power/R2S-0505-HP/945-1764-5-ND/2302761

## Sheet CAN.SchDoc
size A4
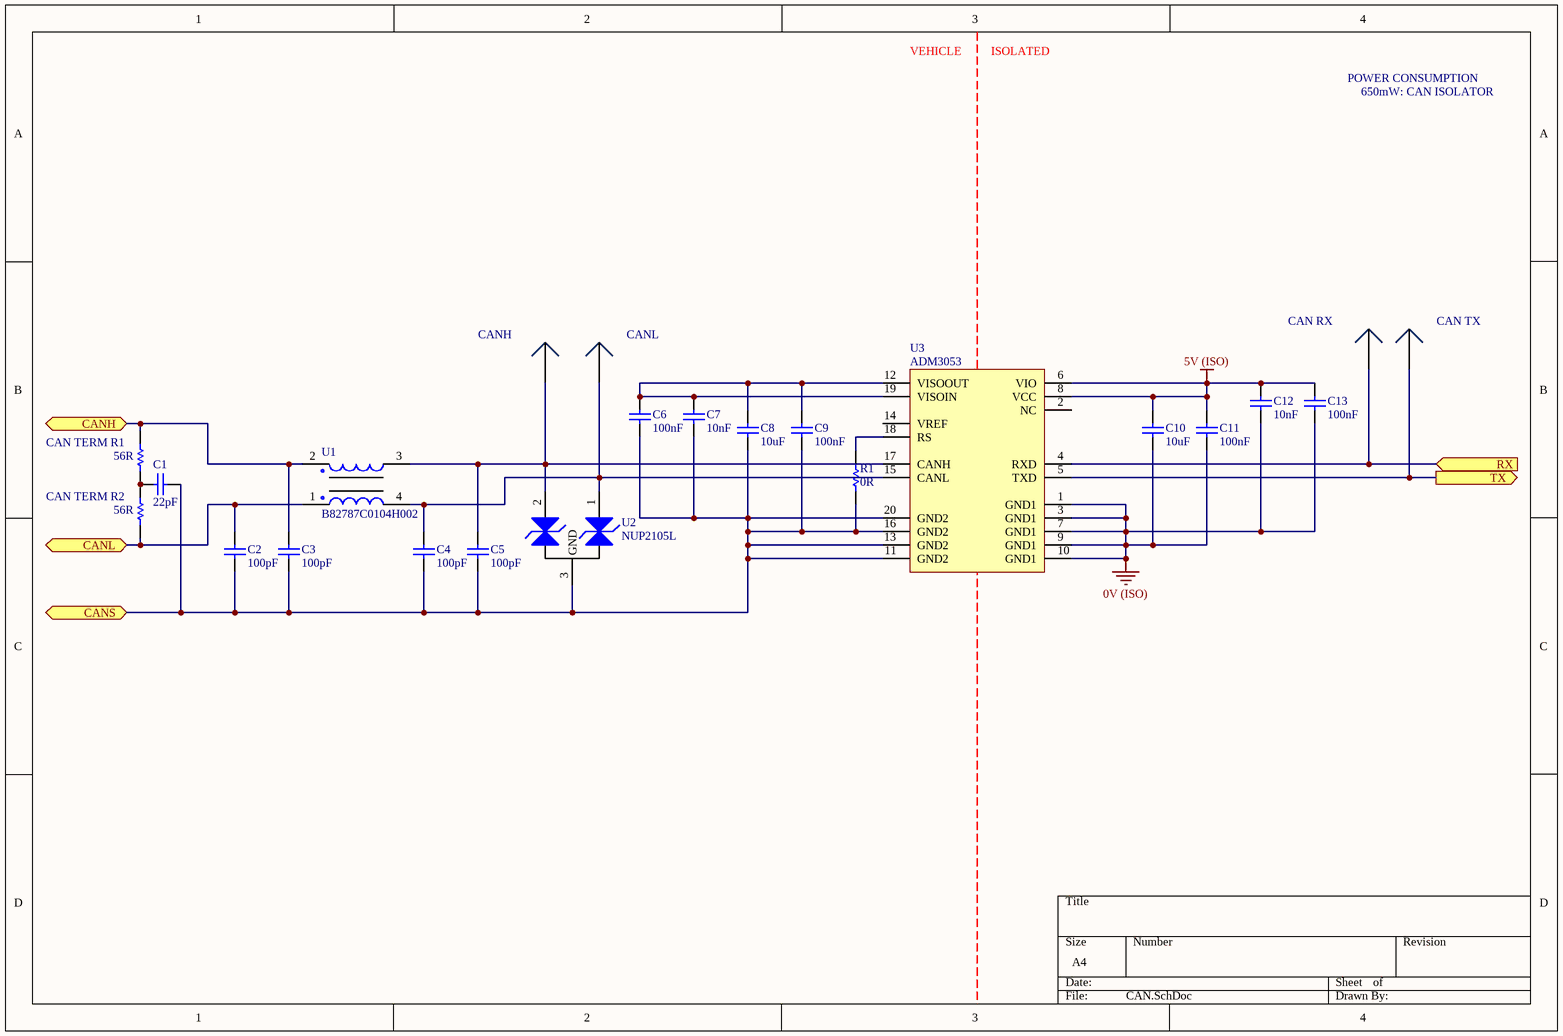
[diagram p5: CAN.SchDoc]

### Parts
(Parts that share a designator on the sheet are numbered #1, #2 ... from top to bottom, then left to right.)
C1  22pF  [0805]
C2  100pF  [0805]
C3  100pF  [0805]
C4  100pF  [0805]
C5  100pF  [0805]
C6  100nF  [0805]
C7  10nF  [1206]
C8  10uF  [0805]
C9  100nF  [0805]
C10  10uF  [0805]
C11  100nF  [0805]
C12  10nF  [1206]
C13  100nF  [0805]
CAN_RX#2  0mm  [SMD Test Point]  (value not drawn)
CAN_TERM_R1  56R  [0805]
CAN_TERM_R2  56R  [0805]
CAN_TX#2  0mm  [SMD Test Point]  (value not drawn)
CANH  0mm  [SMD Test Point]  (value not drawn)
CANL  0mm  [SMD Test Point]  (value not drawn)
R1  0R  [0805]
U1  B82787C0104H002  [TDK 4-PC Pad]
U2  NUP2105L  [ON SOT-23]
U3  ADM3053  [AD SOIC-W 20]

### Ports
CANH (bidir), CANL (bidir), CANS (bidir), RX (in), TX (out)

### Nets
0V (ISO): C10.1 C11.1 C12.1 C13.1 U3.1(GND1) U3.3(GND1) U3.7(GND1) U3.9(GND1) U3.10(GND1)
5V (ISO): C10.2 C11.2 C12.2 C13.2 U3.6(VIO) U3.8(VCC)
CANH_P: C3.2 CAN_TERM_R1.2 U1.2 ; port CANH
CANL_N: C2.2 CAN_TERM_R2.1 U1.1 ; port CANL
CANS: C1.2 C2.1 C3.1 C4.1 C5.1 C6.1 C7.1 C8.1 C9.1 R1.1 U2.3(GND) U3.11(GND2) U3.13(GND2) U3.16(GND2) U3.20(GND2) ; port CANS
NetC1_1: C1.1 CAN_TERM_R1.1 CAN_TERM_R2.2
NetC4_2: C4.2 CANL.1 U1.4 U2.1(CAN_H) U3.15(CANL)
NetC5_2: C5.2 CANH.1 U1.3 U2.2(CAN_L) U3.17(CANH)
NetC6_2: C6.2 C7.2 C8.2 C9.2 U3.12(VISOOUT) U3.19(VISOIN)
NetCAN_RX#2_1: CAN_RX#2.1 U3.4(RXD) ; port RX
NetCAN_TX#2_1: CAN_TX#2.1 U3.5(TXD) ; port TX
NetR1_2: R1.2 U3.18(RS)

Not connected (* = marked no-connect by the designer): U3 2(NC) 14(VREF)

### Notes on the sheet
- VEHICLE
- ISOLATED
- POWER CONSUMPTION
- 650mW: CAN ISOLATOR

### Library data of the parts
C1 = GRM21A5C2E220JW01D: as C45 on sheet Microcontroller; Part Number: GRM21A5C2E220JW01D; Value: 22pF; Digikey Part Number: 490-5534-1-ND
C2-C5 = GCM2165C1H101JA16D: as C16 on sheet BSPD; Part Number: GCM2165C1H101JA16D; Value: 100pF; Digikey Part Number: 490-8031-1-ND
C6 C9 C11 C13 = GCM21BR71H104KA37L: as C18 on sheet BSPD; Part Number: GCM21BR71H104KA37L; Value: 100nF; Digikey Part Number: 490-6064-1-ND
C7 C12 = GCM3195C2A103JA16D: Manufacturer: muRata; Tolerance: 5%; Material: Ceramic; Rated Voltage: 100V; Part Number: GCM3195C2A103JA16D; Value: 10nF; Digikey Part Number: 490-4978-2-ND
C8 C10 = GRM21BR6YA106KE43L: as C14 on sheet BSPD; Part Number: GRM21BR6YA106KE43L; Value: 10uF; Digikey Part Number: 490-10514-6-ND
CAN_RX#2 CAN_TX#2 CANH CANL = SMD Test Point: as 5kW on sheet BSPD; Part Number: SMD Test Point; Pitch: 0mm; Angle: 0
CAN_TERM_R1 CAN_TERM_R2 = RC0805FR0756RL: Manufacturer: YAGEO; Tolerance: 0.01; Rated Voltage: 0.125W; Part Number: RC0805FR0756RL; Value: 56R; Material: FR-07
R1 = RC0805FR070RL: Manufacturer: YAGEO; Tolerance: 0.01; Rated Voltage: 0.125W; Part Number: RC0805FR070RL; Value: 0R; Material: FR-07
U1 = B82787C0104H002: 100µH @ 100kHz 2 Line Common Mode Choke Surface Mount 5.8 kOhms @ 10MHz 150mA DCR 2Ohm; Manufacturer: EPCOS (TDK); Part Number: B82787C0104H002; Inductance: 100µH @ 100kHz; Impedence: 5.8 kOhms @ 10MHz; Material: Wirewound; Rated Current: 150mA; Digikey Part Number: 495-4598-1-ND; Digikey Link: https://www.digikey.com/product-detail/en/epcos-tdk/B82787C0104H002/495-4598-2-ND/3680998
U2 = NUP2105L: Dual Line CAN Bus Protector; Manufacturer: ON Semiconductor; Part Number: NUP2105L; Digikey Part Number: NUP2105LT1GOSCT-ND; Digikey Link: https://www.digikey.com/product-detail/en/on-semiconductor/NUP2105LT1G/NUP2105LT1GOSCT-ND/1485001
U3 = ADM3053: Isolated CAN Transceiver; Manufacturer: Analogue Devices; Part Number: ADM3053; Digikey Part Number: ADM3053BRWZ-ND; Digikey Link: https://www.digikey.com/product-detail/en/analog-devices-inc/ADM3053BRWZ/ADM3053BRWZ-ND/2709332

## Sheet Isolation.SchDoc
size A4
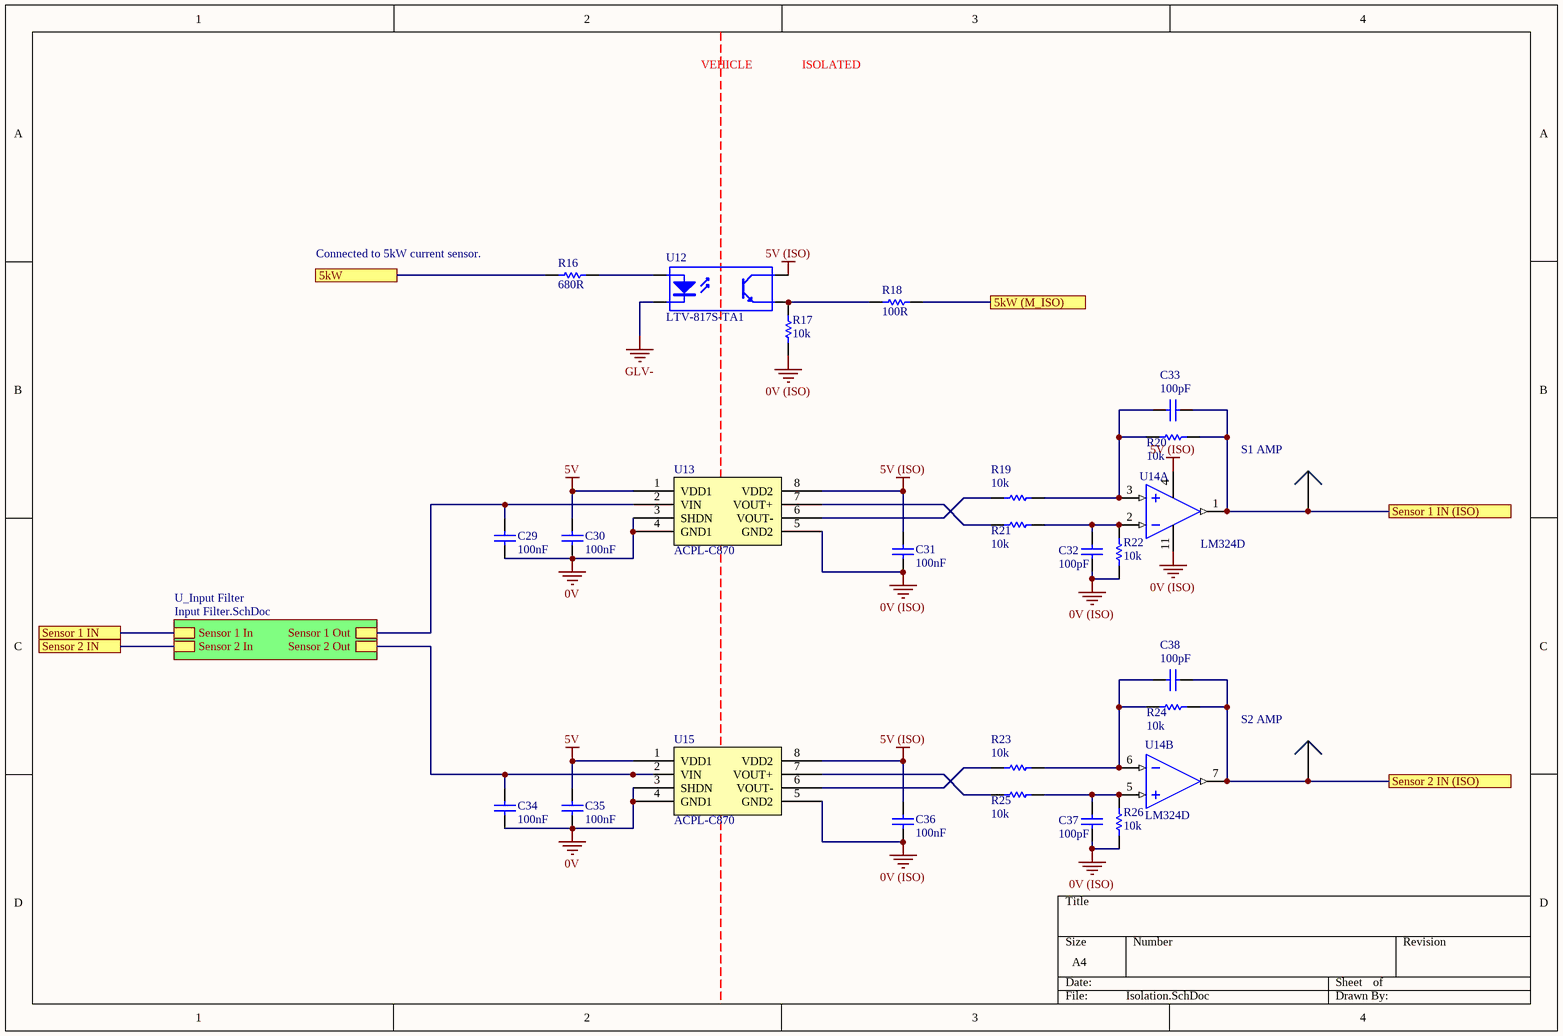
[diagram p6: Isolation.SchDoc]

### Parts
C29  100nF  [0805]
C30  100nF  [0805]
C31  100nF  [0805]
C32  100pF  [0805]
C33  100pF  [0805]
C34  100nF  [0805]
C35  100nF  [0805]
C36  100nF  [0805]
C37  100pF  [0805]
C38  100pF  [0805]
R16  680R  [0805]
R17  10k  [0805]
R18  100R  [0805]
R19  10k  [0805]
R20  10k  [0805]
R21  10k  [0805]
R22  10k  [0805]
R23  10k  [0805]
R24  10k  [0805]
R25  10k  [0805]
R26  10k  [0805]
S1_AMP  0mm  [SMD Test Point]  (value not drawn)
S2_AMP  0mm  [SMD Test Point]  (value not drawn)
U12  LTV-817S-TA1  [ON 4-SMD]
U13  ACPL-C870  [BROAD 8-SOIC]
U14  LM324D  [TI 14-SOIC]  (parts A,B of 4)
U15  ACPL-C870  [BROAD 8-SOIC]

### Sub-sheets
U_Input Filter = Input Filter.SchDoc: Sensor 1 In, Sensor 1 Out, Sensor 2 In, Sensor 2 Out

### Ports
5kW, 5kW (M_ISO), Sensor 1 IN, Sensor 1 IN (ISO), Sensor 2 IN, Sensor 2 IN (ISO)

### Nets
0V: C29.1 C30.1 C34.1 C35.1 U13.3(SHDN) U13.4(GND1) U15.3(SHDN) U15.4(GND1)
0V (ISO): C31.1 C32.1 C36.1 C37.1 R17.1 R22.1 R26.1 U13.5(GND2) U14.11(GND) U15.5(GND2)
5V: C30.2 C35.2 U13.1(VDD1) U15.1(VDD1)
5V (ISO): C31.2 C36.2 U12.4(C) U13.8(VDD2) U14.4(VCC) U15.8(VDD2)
GLV-: U12.2(K)
5kW: R16.2 ; port 5kW
5kW (ISO): R18.1 ; port 5kW (M_ISO)
Sensor 1 IN: port Sensor 1 IN, sheet U_Input Filter/Sensor 1 In
Sensor 2 IN: port Sensor 2 IN, sheet U_Input Filter/Sensor 2 In
NetC29_2: C29.2 U13.2(VIN) ; sheet U_Input Filter/Sensor 1 Out
NetC32_2: C32.2 R21.2 R22.2 U14.2(1IN+)
NetC33_1: C33.1 R20.2 S1_AMP.1 U14.1(1OUT) ; port Sensor 1 IN (ISO)
NetC33_2: C33.2 R19.2 R20.1 U14.3(1IN+)
NetC34_2: C34.2 U15.2(VIN) ; sheet U_Input Filter/Sensor 2 Out
NetC37_2: C37.2 R25.2 R26.2 U14.5(2IN+)
NetC38_1: C38.1 R24.2 S2_AMP.1 U14.7(2OUT) ; port Sensor 2 IN (ISO)
NetC38_2: C38.2 R23.2 R24.1 U14.6(2IN-)
NetR16_1: R16.1 U12.1(A)
NetR17_2: R17.2 R18.2 U12.3(E)
NetR19_1: R19.1 U13.6(VOUT-)
NetR21_1: R21.1 U13.7(VOUT+)
NetR23_1: R23.1 U15.6(VOUT-)
NetR25_1: R25.1 U15.7(VOUT+)

### Notes on the sheet
- VEHICLE
- ISOLATED
- (near R16) Connected to 5kW current sensor.

### Library data of the parts
C29-C31 C34-C36 = GCM21BR71H104KA37L: as C18 on sheet BSPD; Part Number: GCM21BR71H104KA37L; Value: 100nF; Digikey Part Number: 490-6064-1-ND
C32 C33 C37 C38 = GCM2165C1H101JA16D: as C16 on sheet BSPD; Part Number: GCM2165C1H101JA16D; Value: 100pF; Digikey Part Number: 490-8031-1-ND
R16 = RC0805FR07680RL: as R48 on sheet Safety Loops; Part Number: RC0805FR07680RL; Value: 680R; Material: FR-07
R17 R19-R26 = RC0805FR0710KL: as R2 on sheet BSPD; Part Number: RC0805FR0710KL; Value: 10k; Material: FR-07
R18 = RC0805FR07100RL: Manufacturer: YAGEO; Tolerance: 0.01; Rated Voltage: 0.125W; Part Number: RC0805FR07100RL; Value: 100R; Material: FR-07
S1_AMP S2_AMP = SMD Test Point: as 5kW on sheet BSPD; Part Number: SMD Test Point; Pitch: 0mm; Angle: 0
U12 = LTV-817S-TA1: 35V 50ma Optocoupler (VF=1.2V); Manufacturer: Lite-On Inc; Part Number: LTV-817S-TA1; Digikey Part Number: 160-1893-2-ND; Digikey Link: https://www.digikey.com/product-detail/en/lite-on-inc/LTV-817S-TA1/160-1893-2-ND/388451
U13 U15 = ACPL-C870: Isolation Amplifier 1 Circuit Differential 8-SO; Manufacturer: Broadcom Limited; Part Number: ACPL-C870; Digikey Part Number: 516-2578-5-ND; Digikey Link: https://www.digikey.com/product-detail/en/broadcom-limited/ACPL-C870-000E/516-2578-5-ND/3523705
U14 = LM324D: IC OPAMP GP 4 CIRCUIT 14SOIC; Manufacturer: Texas Instruments; Part Number: LM324D; Digikey Part Number: 296-1390-5-ND; Digikey Link: https://www.digikey.com/product-detail/en/texas-instruments/LM324D/296-1390-5-ND/277039

## Sheet Input Filter.SchDoc
size A4
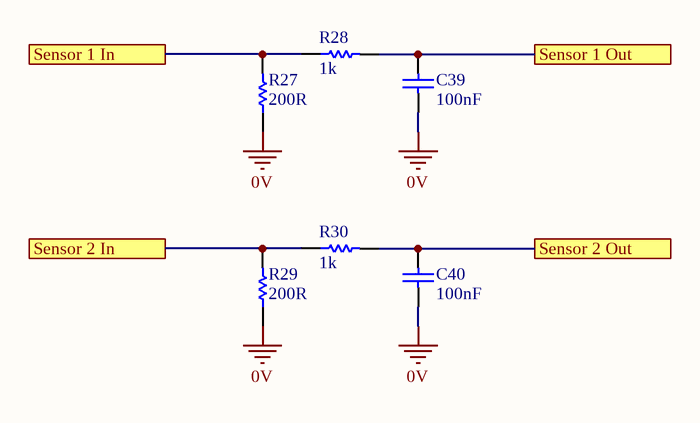
[diagram p7: Input Filter.SchDoc]

### Parts
C39  100nF  [0805]
C40  100nF  [0805]
R27  200R  [0805]
R28  1k  [0805]
R29  200R  [0805]
R30  1k  [0805]

### Ports
Sensor 1 In, Sensor 1 Out, Sensor 2 In, Sensor 2 Out

### Nets
0V: C39.1 C40.1 R27.1 R29.1
Sensor 1 IN: R27.2 R28.1 ; port Sensor 1 In
Sensor 2 IN: R29.2 R30.1 ; port Sensor 2 In
NetC29_2: C39.2 R28.2 ; port Sensor 1 Out
NetC34_2: C40.2 R30.2 ; port Sensor 2 Out

### Library data of the parts
C39 C40 = GCM21BR71H104KA37L: as C18 on sheet BSPD; Part Number: GCM21BR71H104KA37L; Value: 100nF; Digikey Part Number: 490-6064-1-ND
R27 R29 = RC0805FR07200RL: Manufacturer: YAGEO; Tolerance: 0.01; Rated Voltage: 0.125W; Part Number: RC0805FR07200RL; Value: 200R; Material: FR-07
R28 R30 = RC0805FR071KL: Manufacturer: YAGEO; Tolerance: 0.01; Rated Voltage: 0.125W; Part Number: RC0805FR071KL; Value: 1k; Material: FR-07

## Nets that join several sheets
0V: Power Supply (8 pins), Isolation (8 pins), Input Filter (C39.1 C40.1 R27.1 R29.1)
0V (ISO): BSPD (22 pins), Microcontroller (32 pins), Safety Loops (Q1.S Q2.S), Power Supply (0V_(ISO).1 C28.1 R15.1 U11.4), CAN (9 pins), Isolation (10 pins)
5V: Power Supply (5 pins), Isolation (C30.2 C35.2 U13.1 U15.1)
5V (ISO): BSPD (17 pins), Microcontroller (5 pins), Safety Loops (6 pins), Power Supply (5V_(ISO).1 C28.2 D5.A U11.5), CAN (6 pins), Isolation (6 pins)
GLV+: Top Level (Sensors_Plug.3 Sensors_Plug.4 Universal_Plug.12), Power Supply (F1.1 GLV+.1)
GLV-: Top Level (Sensors_Plug.1 Sensors_Plug.6 Universal_Plug.11), Power Supply (C24.1 GLV-.1 U9.4), Isolation (U12.2)
5kW: Top Level (Universal_Plug.8), Isolation (R16.2)
5kW (ISO): BSPD (5kW.1 R8.1 U6.4), Microcontroller (U16.29), Isolation (R18.1)
BSPD DELAY (ISO): BSPD (R6.1 U4.9), Microcontroller (U16.25), Safety Loops (Q2.G)
BSPD OK: BSPD (5 pins), Microcontroller (U16.30), Safety Loops (Q1.G)
CANH_P: Top Level (Universal_Plug.5), CAN (C3.2 CAN_TERM_R1.2 U1.2)
CANL_N: Top Level (Universal_Plug.4), CAN (C2.2 CAN_TERM_R2.1 U1.1)
CANS: Top Level (Universal_Plug.1), CAN (15 pins)
CLOCK: BSPD (6 pins), Microcontroller (U16.26)
Green Loop IN: Top Level (Universal_Plug.10), Safety Loops (BSPD_Bypass.3 K1.9)
Green Loop OUT: Top Level (Universal_Plug.9), Safety Loops (BSPD_Delay_Bypass.2 K2.13)
NetC29_2: Isolation (C29.2 U13.2), Input Filter (C39.2 R28.2)
NetC33_1: BSPD (S1.1 U5.4 U5.7), Microcontroller (U16.43), Isolation (C33.1 R20.2 S1_AMP.1 U14.1)
NetC34_2: Isolation (C34.2 U15.2), Input Filter (C40.2 R30.2)
NetC38_1: BSPD (S2.1 U5.8 U5.11), Microcontroller (U16.42), Isolation (C38.1 R24.2 S2_AMP.1 U14.7)
NetCAN_RX#2_1: Microcontroller (U16.46), CAN (CAN_RX#2.1 U3.4)
NetCAN_TX#2_1: Microcontroller (U16.45), CAN (CAN_TX#2.1 U3.5)
NetHigh_P_1: BSPD (6 pins), Microcontroller (U16.28)
NetLow_P_1: BSPD (5 pins), Microcontroller (U16.27)
Sensor 1 IN: Top Level (Sensors_Plug.2), Input Filter (R27.2 R28.1)
Sensor 2 IN: Top Level (Sensors_Plug.5), Input Filter (R29.2 R30.1)